# EasyEDA Pro project ProProject_Access Control AC Power Switch_2024-06-06.epro, schematic V2.0.1B Schematic
Create Date: 2024-05-14; Page Name: Main Page; Project Name: Access Control V2.1; Schematic Name: V2.0.1B Power Relay Schematic; Update Date: 2024-05-22; Company: RIT SHED MAKERSPACE; Drawn: Jim Heaney; Page Size: A4; Part Number: N/A; Reviewed: Jim Heaney; Version: V2.1.0
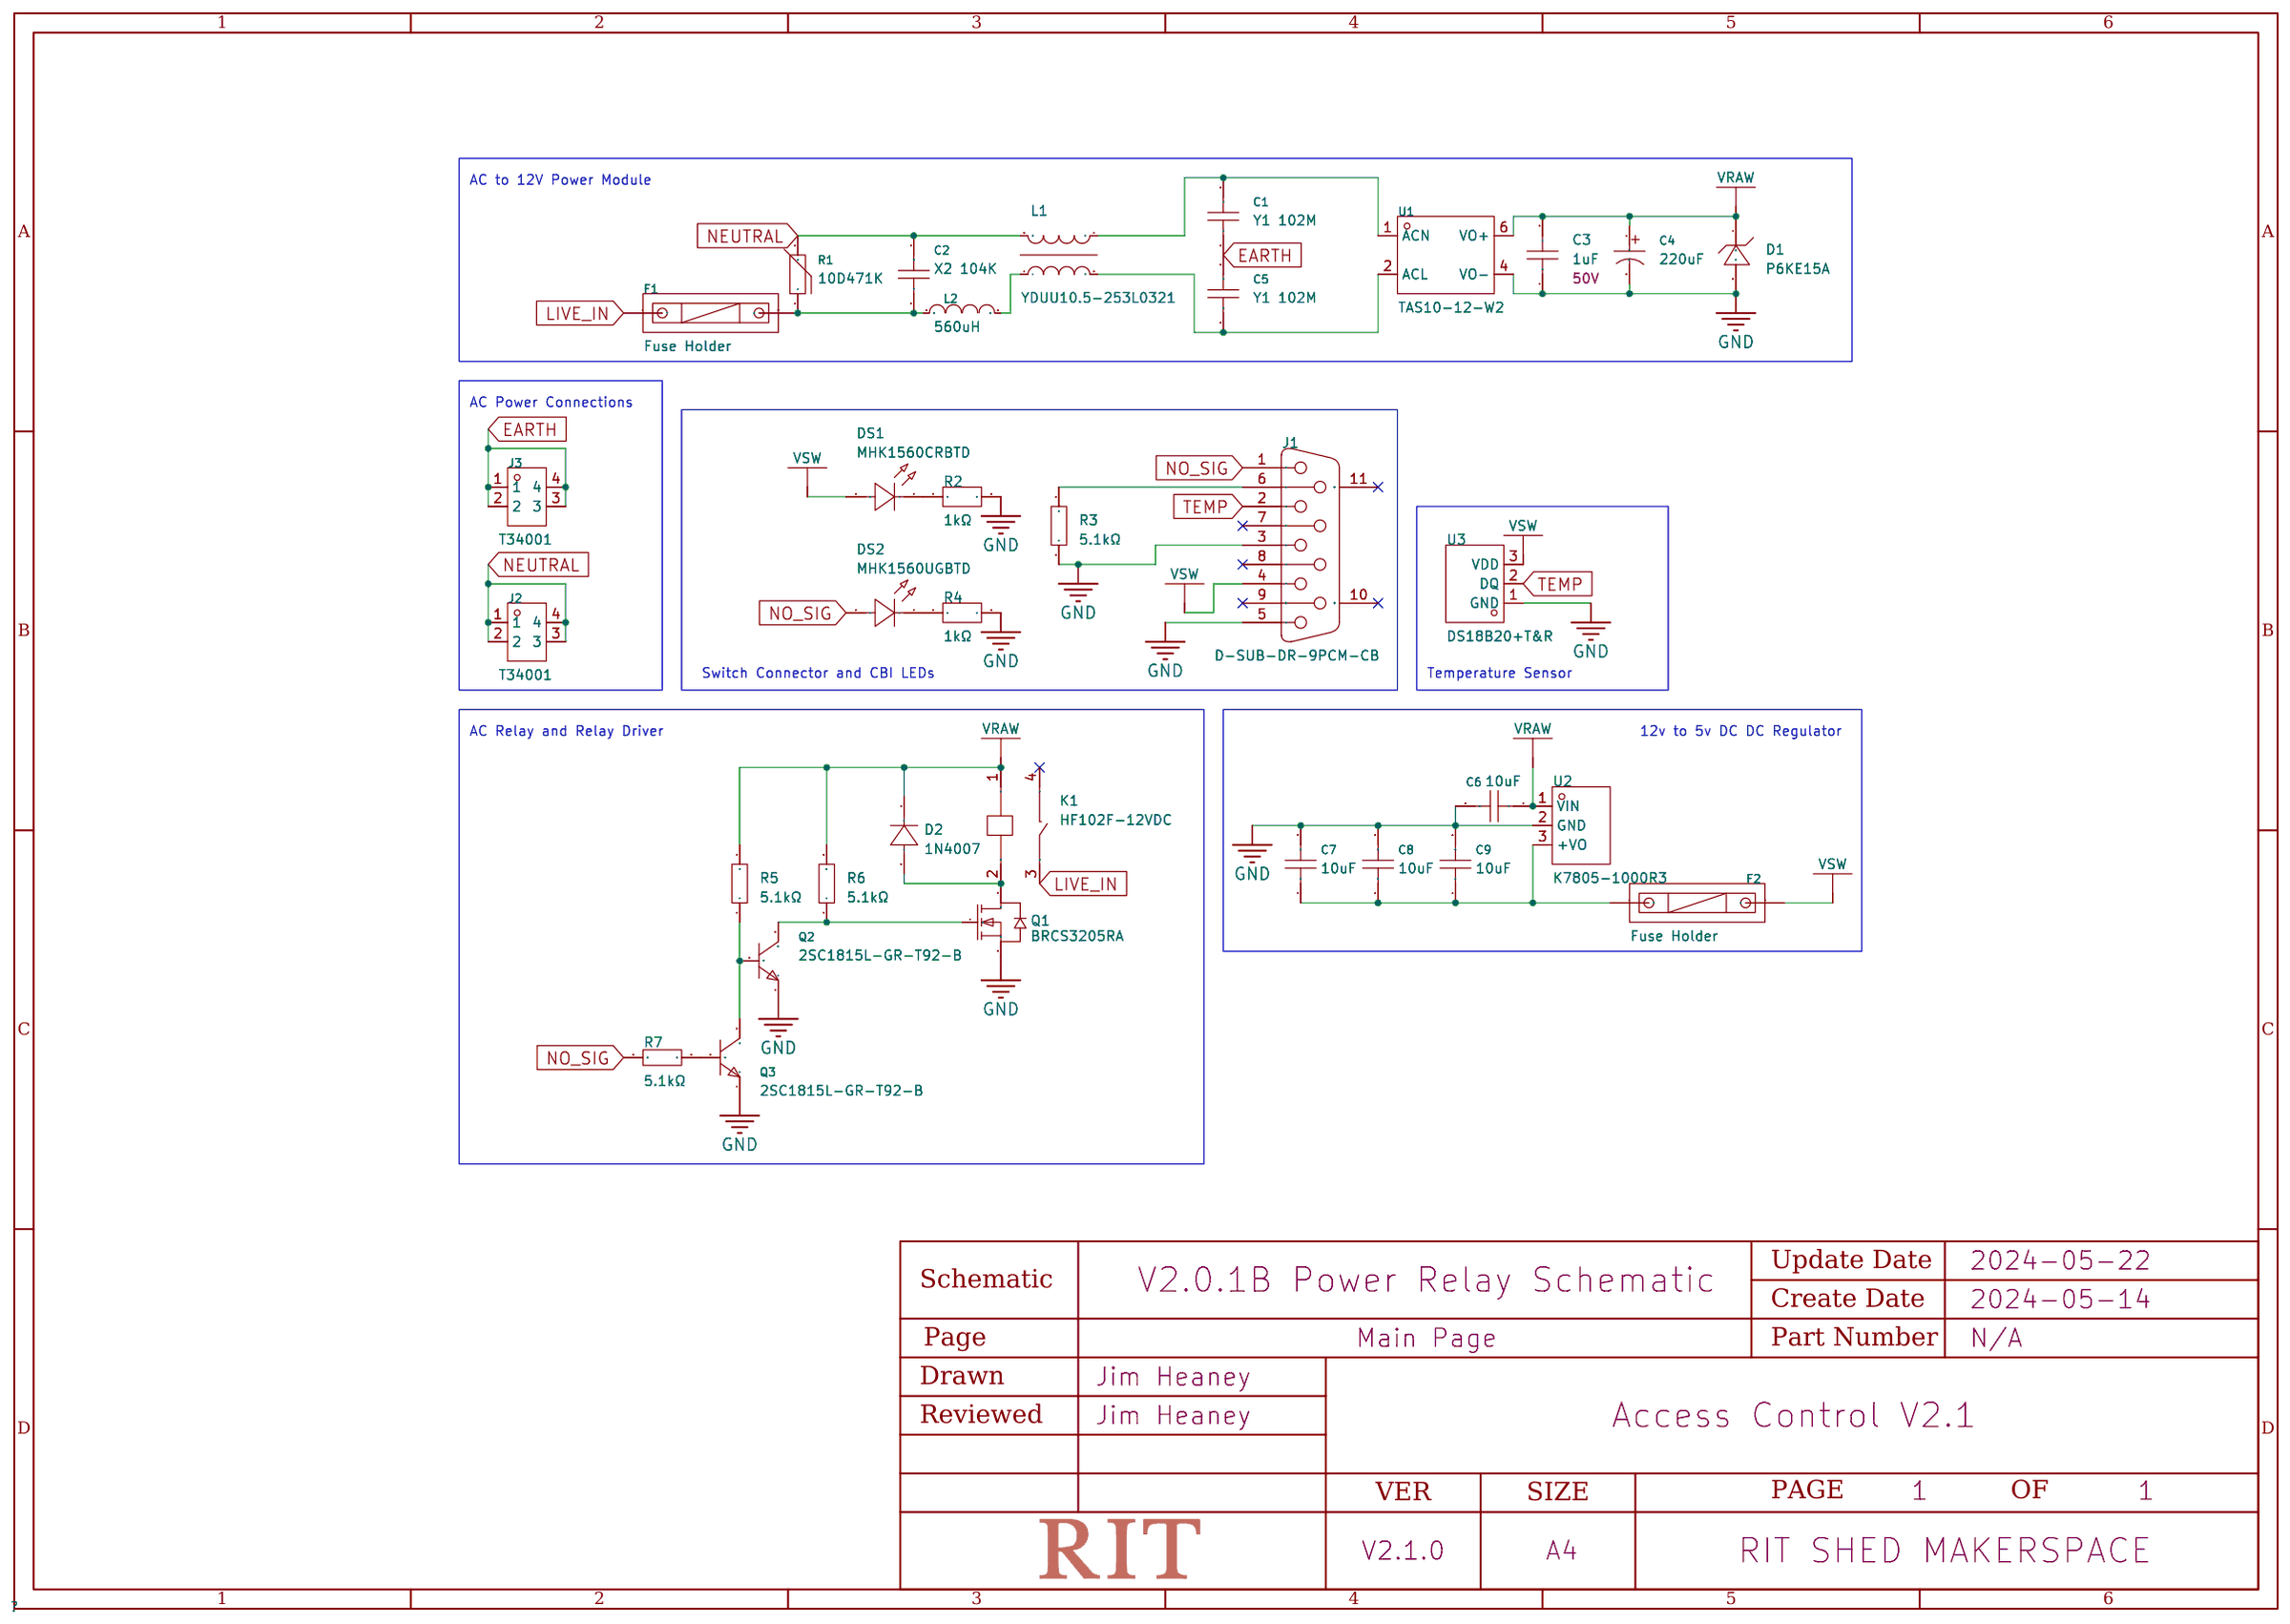
[diagram p1: schematic sheet]

## Parts
C1  1nF  [CAP-TH_L8.5-W5.0-P10.00-D0.6]
C2  100nF  [CAP-TH_L10.0-W5.0-P7.50-D0.6]
C3  1uF  [CAP-TH_L5.5-W3.5-P5.00-D1.2]
C4  220uF  [CAP-TH_BD6.3-P2.50-D1.0-FD]
C5  1nF  [CAP-TH_L8.5-W5.0-P10.00-D0.6]
C6  10uF  [CAP-TH_L5.5-W3.8-P3.50-D0.6]
C7  10uF  [CAP-TH_L5.5-W3.8-P3.50-D0.6]
C8  10uF  [CAP-TH_L5.5-W3.8-P3.50-D0.6]
C9  10uF  [CAP-TH_L5.5-W3.8-P3.50-D0.6]
D1  P6KE15A  [DO-15_BD3.2-L6.4-P10.40-D0.8-RD]
D2  1N4007  [DO-41_BD2.4-L4.7-P8.70-D0.8-RD]
DS1  MHK1560CRBTD  [LED-TH_MHK1560UGBTD]
DS2  MHK1560UGBTD  [LED-TH_MHK1560UGBTD]
F1  Fuse Holder  [FUSE-TH_L24.5-W9.8-P22.5]
F2  Fuse Holder  [FUSE-TH_L24.5-W9.8-P22.5]
J1  D-SUB-DR-9PCM-CB  [DB9-TH_ID09S33E4GV00LF]
J2  T34001  [CONN-TH_T34001]
J3  T34001  [CONN-TH_T34001]
K1  HF102F-12VDC  [RELAY-TH_HF102F-12VDC]
L1  YDUU10.5-253L0321  [IND-TH_4P-L19.0-W17.0]
L2  560uH  [IND-TH_BD9.0-P5.00-D0.7]
Q1  BRCS3205RA  [TO-220-3_L10.0-W4.5-P2.54-L]
Q2  2SC1815L-GR-T92-B  [TO-92-3_L4.9-W3.7-P2.54-L]
Q3  2SC1815L-GR-T92-B  [TO-92-3_L4.9-W3.7-P2.54-L]
R1  10D471K  [RES-TH_L12.5-W6.7-P7.50-D1.2]
R2  1kΩ  [RES-TH_BD2.3-L6.5-P10.50-D0.5]
R3  5.1kΩ  [RES-TH_BD2.3-L6.5-P10.50-D0.5]
R4  1kΩ  [RES-TH_BD2.3-L6.5-P10.50-D0.5]
R5  5.1kΩ  [RES-TH_BD2.3-L6.5-P10.50-D0.5]
R6  5.1kΩ  [RES-TH_BD2.3-L6.5-P10.50-D0.5]
R7  5.1kΩ  [RES-TH_BD2.3-L6.5-P10.50-D0.5]
U1  TAS10-12-W2  [PWRM-TH_TAS10-XX-W2]
U2  K7805-1000R3  [PWRM-TH_YLPTEC_K78XX-1000R3]
U3  DS18B20+T&R  [TO-92-3_L4.9-W3.7-P2.54-L]

## Library data of the parts
C1 C5 = VY1102M31Y5UC63V0: Capacitance: Tolerance:±20% Tolerance:±20% Voltage(AC):760V Subclass: Operating Temperature:-40℃~+125℃ Operating Temperature:-40℃~+125℃; LCSC Part Name: 等级:X1,Y1 1nF ±20% 760V; Supplier Part: C1620957; Manufacturer: VISHAY(威世); Supplier Footprint: 插件,P=10mm; JLCPCB Part Class: Extended Part; Datasheet: https://atta.szlcsc.com/upload/public/pdf/source/20210503/4C6D9DFEC0766624DBEA7F26F929BB18.pdf; Supplier: LCSC; Tolerance: ±20%; Voltage(AC): 760V; Operating Temperature: -40℃~+125℃
C2 = PX104K2C0702: Capacitance: Tolerance:±10% Tolerance:±10% Voltage(AC):310V；380V；350V Subclass: Operating Temperature:-40℃~+110℃ Operating Temperature:-40℃~+110℃; LCSC Part Name: 等级:X2 100nF ±10% 310V 350V 380V; Supplier Part: C2693793; Manufacturer: KYET(科雅); Supplier Footprint: 插件,P=7.5mm; JLCPCB Part Class: Extended Part; Datasheet: https://atta.szlcsc.com/upload/public/pdf/source/20230824/212A883DA7F3524E26A294E17BC5A0F4.pdf; Supplier: LCSC; Tolerance: ±10%; Voltage(AC): 310V；380V；350V; Operating Temperature: -40℃~+110℃
C3 = FK26X7R1H105KRE06: Capacitance: Tolerance:±10% Tolerance:±10% Voltage Rated: Lead Spacing: Temperature Coefficient:; LCSC Part Name: 1uF ±10% 50V; Supplier Part: C2839237; Manufacturer: TDK; Supplier Footprint: 插件,P=5mm; JLCPCB Part Class: Extended Part; Datasheet: https://atta.szlcsc.com/upload/public/pdf/source/20211011/CA0C243CD946D294CDFF83D03DB16AD9.pdf; Supplier: LCSC; Tolerance: ±10%; Voltage Rated: 50V
C4 = KM227M025E11RR0VH2FP0: Capacitance:220uF Tolerance:±20% Tolerance:±20% Rated Voltage: Ripple Current:- Equivalent Series Resistance(ESR):- Lead Spacing: φD: L: Lifetime @ Temp:1000hrs@105℃; LCSC Part Name: 220uF ±20% 25V; Supplier Part: C12450; Manufacturer: CX(承兴); Supplier Footprint: 插件,D6.3xL11mm; JLCPCB Part Class: Extended Part; Datasheet: https://atta.szlcsc.com/upload/public/pdf/source/20211027/06D6BA3719C264B639DC286D935D03EA.pdf; Supplier: LCSC; Tolerance: ±20%; Lifetime @ Temp: 1000hrs@105℃
C6-C9 = CD1E106MC9BER2F100: Capacitance:10uF Tolerance:±20% Tolerance:±20% Voltage Rated: Temperature Coefficient:; LCSC Part Name: 10uF ±20% 25V; Supplier Part: C2761733; Manufacturer: Dersonic(德尔创); Supplier Footprint: 插件,P=5.08mm; JLCPCB Part Class: Extended Part; Datasheet: https://atta.szlcsc.com/upload/public/pdf/source/20210512/C2761733_48A4F8FFA54EF14BEC181E01EC41507A.pdf; Supplier: LCSC; Tolerance: ±20%
D1 = P6KE15A_C1974865: polarity:Unidirectional Reverse Stand-Off Voltage (Vrwm):12.8V Maximum Clamping Voltage:21.2V Peak Pulse Current (Ipp)@10/1000us:28.8A Peak Pulse Power Dissipation (Ppp)@10/1000us:600W Breakdown Voltage:14.3V Type:TVS; LCSC Part Name: TVS 12.8V截止 28.8A峰值脉冲; Supplier Part: C1974865; Manufacturer: Littelfuse(美国力特); Supplier Footprint: DO-15(DO-204AC); JLCPCB Part Class: Extended Part; Datasheet: https://atta.szlcsc.com/upload/public/pdf/source/20210316/C2760121_CE745CC1535F4E7F6CA9D58EF9C8652B.pdf; Supplier: LCSC; polarity: Unidirectional; Reverse Stand-Off Voltage (Vrwm): 12.8V; Maximum Clamping Voltage: 21.2V; Peak Pulse Current (Ipp)@10/1000us: 28.8A; Peak Pulse Power Dissipation (Ppp)@10/1000us: 600W; Breakdown Voltage: 14.3V; Type: TVS
D2 = 1N4007_C2985028: Forward Voltage (Vf@If):1V@1A Reverse Voltage (Vr): Average Rectified Current (Io):; LCSC Part Name: 电压:1kV 电流:1A; Supplier Part: C2985028; Manufacturer: GOODWORK(固得沃克); Supplier Footprint: DO-41; JLCPCB Part Class: Extended Part; Datasheet: https://atta.szlcsc.com/upload/public/pdf/source/20210723/C2848669_ECFE0BC1B34B7BAAA686846FF0F306A7.pdf; Supplier: LCSC; Forward Voltage (Vf@If): 1V@1A
DS1 = MHK1560CGBTD: 20mA 雾状红透镜 50mcd -40℃~+85℃ 632nm Red 85° 1.75V~2.2V Plugin,P=2.54mm Light Emitting Diodes (LED) ROHS; LCSC Part Name: 1560直插单灯翠绿色光; Supplier Part: C7470835; Manufacturer: MEIHUA(美华); Supplier Footprint: 插件,P=2.54mm; JLCPCB Part Class: Extended Part; Datasheet: https://atta.szlcsc.com/upload/public/pdf/source/20231114/0151DB1F997DCF286213A722D08B4BAA.pdf; Supplier: LCSC; Emitted Color: Emerald; Forward Voltage (VF): 1.75V~2.2V; Forward Current: 20mA; Dominant Wavelength: 520nm; Lens Color: 雾状绿透镜; Luminous Intensity: 1000mcd; Viewing Angle: 85°; Operating Temperature: -40℃~+85℃
DS2 = MHK1560UGBTD: Emitted Color:Emerald Forward Voltage (VF):1.75V~2.2V Forward Voltage (VF):1.75V~2.2V Forward Current:20mA Dominant Wavelength:520nm Dominant Wavelength:520nm Lens Color:雾状绿透镜 Luminous Intensity:1000mcd Luminous Intensity:1000mcd Viewing Angle:85° Operati; LCSC Part Name: 1560直插单灯翠绿色光; Supplier Part: C7470833; Manufacturer: MEIHUA(美华); Supplier Footprint: 插件,P=2.54mm; JLCPCB Part Class: Extended Part; Datasheet: https://atta.szlcsc.com/upload/public/pdf/source/20231114/0151DB1F997DCF286213A722D08B4BAA.pdf; Supplier: LCSC; Emitted Color: Emerald; Forward Voltage (VF): 1.75V~2.2V; Forward Current: 20mA; Dominant Wavelength: 520nm; Lens Color: 雾状绿透镜; Luminous Intensity: 1000mcd; Viewing Angle: 85°; Operating Temperature: -40℃~+85℃
F1 F2 = 保险丝透明座: Fuseholder Type:- Fuse Type:- Fuse Size:-; LCSC Part Name: 保险丝座 5*20 透明座(两件套); Supplier Part: C58066; Manufacturer: xcfuse(旭程); JLCPCB Part Class: Extended Part; Datasheet: https://atta.szlcsc.com/upload/public/pdf/source/20201109/C58066_EF84FEEE40948BE1BD26BCA72E4FE443.pdf; Supplier: LCSC
J1 = D-SUB-DR-9PCM-CB: Connector Type:D-Sub Gender:Female Number of Pins:9P Mounting Style:Right-Angle Number of Rows:2 Current Rating (Max):3A Contact Plating:Tin Operating Temperature Range:-50℃~+105℃ Operating Temperature Range:-50℃~+105℃; LCSC Part Name: D-Sub 母 P数:9P; Supplier Part: C19077337; Manufacturer: XUNPU(讯普); Supplier Footprint: 弯插; JLCPCB Part Class: Extended Part; Datasheet: https://atta.szlcsc.com/upload/public/pdf/source/20231108/FB2E8AB0BE4F620DDF3F7F4D0B9AFB97.pdf; Supplier: LCSC; Connector Type: D-Sub; Gender: Female; Number of Pins: 9P; Mounting Style: Right-Angle; Number of Rows: 2; Current Rating (Max): 3A; Contact Plating: Tin; Operating Temperature Range: -50℃~+105℃
J2 J3 = T34001: LCSC Part Name: 四脚 M3 二件套; Supplier Part: C481448; Manufacturer: XFCN(兴飞); Supplier Footprint: 插件; JLCPCB Part Class: Extended Part; Datasheet: https://atta.szlcsc.com/upload/public/pdf/source/20200107/C481448_4214B4EB74A46B70BD82BA8A456D4EDD.pdf; Supplier: LCSC
K1 = HF102F-12VDC: Coil Voltage:12V Contact Form:一组常开:1A(SPST-常开) Pin Number:4 Contact Rating:20A@250VAC Maximum Switching Voltage:250V@AC Coil Rated Power:900mW Contact Material:AgCdO Maximum Switching Current:25A Coil Type:无极性-单线圈 Coil Resistance:640Ω Contact Resistance:1; LCSC Part Name: 小型大功率12V继电器 单刀单掷-常开 适用于电机负载; Supplier Part: C250652; Manufacturer: HF(宏发); Supplier Footprint: 插件,16x30.5mm; JLCPCB Part Class: Extended Part; Datasheet: https://atta.szlcsc.com/upload/public/pdf/source/20180709/C250652_2CDFE87553D11B6EDA7440E1EF3F00EA.pdf; Supplier: LCSC; Coil Voltage: 12V; Contact Form: 一组常开:1A(SPST-常开); Pin Number: 4; Contact Rating: 20A@250VAC; Maximum Switching Voltage: 250V@AC; Coil Rated Power: 900mW; Contact Material: AgCdO; Maximum Switching Current: 25A; Coil Type: 无极性-单线圈; Coil Resistance: 640Ω; Contact Resistance: 100mΩ; Operate Time: 20ms; Release Time: 10ms; Operating Temperature: -25℃~+85℃
L1 = YDUU10.5-253L0321: Number of Lines:2 Withstanding Voltage:1.5kV@AC Inductance @ Frequency:25mH@1KHz; LCSC Part Name: UU10.5 25mH @1KHz; Supplier Part: C5200263; Manufacturer: YJYCOIN(益嘉源); Supplier Footprint: 插件,19x17x22mm; JLCPCB Part Class: Extended Part; Datasheet: https://atta.szlcsc.com/upload/public/pdf/source/20221019/CF3EF2D4E89C9F1A1EF6A77931981DBC.pdf; Supplier: LCSC; Number of Lines: 2; Withstanding Voltage: 1.5kV@AC; Inductance @ Frequency: 25mH@1KHz
L2 = PK0810-561KB: Inductance: Tolerance:±10% Tolerance:±10% Rated Current: DC Resistance (DCR): Type:工字电感; LCSC Part Name: 560uH ±10%; Supplier Part: C122800; Manufacturer: SXN(顺翔诺); Supplier Footprint: 插件; JLCPCB Part Class: Extended Part; Datasheet: https://atta.szlcsc.com/upload/public/pdf/source/20210810/BA6D1DA7D4BCBB7C641BC97B42CFC6FF.pdf; Supplier: LCSC; Tolerance: ±10%; Type: 工字电感
Q1 = BRCS3205RA: Type:1个NChannel Drain Source Voltage (Vdss): Continuous Drain Current (Id): Power Dissipation (Pd): Drain Source On Resistance (RDS(on)@Vgs,Id):8mΩ@10V,90A Gate Threshold Voltage (Vgs(th)@Id):4V@250uA; LCSC Part Name: 1个N沟道 耐压:55V 电流:110A; Supplier Part: C328558; Manufacturer: BLUE ROCKET(蓝箭); Supplier Footprint: TO-220; JLCPCB Part Class: Extended Part; Datasheet: https://atta.szlcsc.com/upload/public/pdf/source/20240305/A90DF5FC3A17D55D4D137BD96C179E31.pdf; Supplier: LCSC; Type: 1个NChannel; Drain Source On Resistance (RDS(on)@Vgs,Id): 8mΩ@10V,90A; Gate Threshold Voltage (Vgs(th)@Id): 4V@250uA
Q2 Q3 = 2SC1815L-GR-T92-B: Transistor Type: Collector Current (Ic): Collector-Emitter Breakdown Voltage (Vceo): Power Dissipation (Pd):; LCSC Part Name: 耐压:50V 电流:150mA NPN hfe=200~400; Supplier Part: C73309; Manufacturer: UTC(友顺); Supplier Footprint: TO-92-2.54mm; JLCPCB Part Class: Extended Part; Datasheet: https://atta.szlcsc.com/upload/public/pdf/source/20170209/1486607344255.pdf; Supplier: LCSC
R1 = 10D471K_C8760: Varistor Voltage:423V~517V Varistor Voltage:423V~517V Clamping Voltage: Allowable Voltage (DC): Allowable Voltage (AC): Peak Current: Maximum Energy:42.3J Maximum Energy:42.3J Typical Capatitance:190pF@1kHz; LCSC Part Name: 钳位电压775V 42.3焦耳 插件压敏电阻; Supplier Part: C8760; Manufacturer: RUILON(瑞隆源); Supplier Footprint: 插件; JLCPCB Part Class: Extended Part; Datasheet: https://atta.szlcsc.com/upload/public/pdf/source/20160725/1469440740918.pdf; Supplier: LCSC; Varistor Voltage: 423V~517V; Maximum Energy: 42.3J; Typical Capatitance: 190pF@1kHz
R2 R4 = MF1/4W-1KΩ±1%T52: Type:Metal Film Resistors Resistance: Tolerance:±1% Tolerance:±1% Power(Watts):250mW Temperature Coefficient:±200ppm/℃ Temperature Coefficient:±200ppm/℃; LCSC Part Name: 金属膜电阻 1kΩ ±1% 250mW; Supplier Part: C713997; Manufacturer: 华星机电; Supplier Footprint: 插件,D2.3xL6.5mm; JLCPCB Part Class: Extended Part; Datasheet: https://atta.szlcsc.com/upload/public/pdf/source/20200731/C713882_AE8EB1102749D7E4FB4FB13DC898C429.pdf; Supplier: LCSC; Type: Metal Film Resistors; Tolerance: ±1%; Power(Watts): 250mW; Temperature Coefficient: ±200ppm/℃
R3 R5-R7 = CF1/4W-5.1KΩ±5% T: Type:Carbon Resister Resistance: Tolerance:±5% Tolerance:±5% Overload Voltage (Max):250V Power(Watts):250mW Temperature Coefficient:±350ppm/℃ Temperature Coefficient:±350ppm/℃ Operating Temperature Range:-55℃~+155℃ Operating Temperature Range:-55℃~+155℃; LCSC Part Name: 5.1kΩ ±5% 250mW 碳膜电阻; Supplier Part: C120072; Manufacturer: CCO(千志电子); Supplier Footprint: 插件,D2.3xL6.5mm; JLCPCB Part Class: Extended Part; Datasheet: https://atta.szlcsc.com/upload/public/pdf/source/20190910/C427328_A0A2D65F3FD547937F4E674C90868175.pdf; Supplier: LCSC; Type: Carbon Resister; Tolerance: ±5%; Overload Voltage (Max): 250V; Power(Watts): 250mW; Temperature Coefficient: ±350ppm/℃; Operating Temperature Range: -55℃~+155℃
U1 = TAS10-12-W2: Conversion Type:AC-DC；AC/DC-DC Input Voltage(DC):100V~370V Input Voltage(DC):100V~370V Output Voltage:12V Output Voltage:12V Output Power:10W Input Voltage(AC):85VAC~265VAC Input Voltage(AC):85VAC~265VAC Output Current (Max):830mA Output Current (Max):830; Supplier Part: C2687656; Manufacturer: TDPOWER(腾达电源); Supplier Footprint: 插件,25x39mm; JLCPCB Part Class: Extended Part; Datasheet: https://atta.szlcsc.com/upload/public/pdf/source/20210914/95F169B7B21081D929A6CFE8A15609A6.pdf; Supplier: LCSC; Conversion Type: AC-DC；AC/DC-DC; Input Voltage(DC): 100V~370V; Output Voltage: 12V; Output Power: 10W; Input Voltage(AC): 85VAC~265VAC; Output Current (Max): 830mA; Function: 降压型; Isolation or not: 隔离; Output Channel: 1; Insulated Voltage: 2.5kV@AC; Conversion Efficiency: 85%; Feature: Overcurrent Protection；短路保护自恢复
U2 = K7805-1000R3: Conversion Type:DC-DC Input Voltage(DC):8V~36V Input Voltage(DC):8V~36V Output Voltage:5V Output Voltage:5V Output Power:5W Output Current (Max):1A Output Current (Max):1A Function:升降压型 Isolation or not:非隔离 Output Channel:1 Insulated Voltage:- Conversion; LCSC Part Name: DC-DC 输入电压8V~36V 输出电压5V输出功率5W1000mA; Supplier Part: C2992391; Manufacturer: YLPTEC(易川); Supplier Footprint: 插件; JLCPCB Part Class: Extended Part; Datasheet: https://atta.szlcsc.com/upload/public/pdf/source/20220510/13042FEFCE8A01FC3BA968F60B4D6D28.pdf; Supplier: LCSC; Conversion Type: DC-DC; Input Voltage(DC): 8V~36V; Output Voltage: 5V; Output Power: 5W; Output Current (Max): 1A; Function: 升降压型; Isolation or not: 非隔离; Output Channel: 1; Conversion Efficiency: 93%; Feature: Short-Circuit Protection；Low-Power Consumption; Maximum Capacitive Load: 680uF
U3 = DS18B20+T&R: Supply Voltage:3V~5.5V Supply Voltage:3V~5.5V; Supplier Part: C880672; Manufacturer: ADI(亚德诺)/MAXIM(美信); Supplier Footprint: TO-92; JLCPCB Part Class: Extended Part; Datasheet: https://atta.szlcsc.com/upload/public/pdf/source/20201223/C880672_EEBB787AABBE3FE11FE7BE07B2E2EC5E.pdf; Supplier: LCSC; Supply Voltage: 3V~5.5V

## Nets
GND: C3.1 C4.2 C6.2 C7.2 C8.2 C9.2 D1.2(A) J1.3 J1.5 Q1.3(S) Q2.1(E) Q3.1(E) R2.2 R3.1 R4.2 U1.4(VO-) U2.2(GND) U3.1(GND)
EARTH: C1.1 C5.2 J3.1 J3.2 J3.3 J3.4
LIVE_IN: F1.1 K1.3
NEUTRAL: C2.2 J2.1 J2.2 J2.3 J2.4 L1.3 R1.2
NO_SIG: DS2.2(A) J1.1 R7.1
TEMP: J1.2 U3.2(DQ)
VRAW: C3.2 C4.1 C6.1 D1.1(C) D2.1(K) K1.1 R5.2 R6.2 U1.6(VO+) U2.1(VIN)
VSW: DS1.2(A) F2.2 J1.4 U3.3(VDD)
$1N597: C2.1 F1.2 L2.1 R1.1
$1N1225: C7.1 C8.1 C9.1 F2.1 U2.3(+VO)
$1N1636: D2.2(A) K1.2 Q1.2(D)
$1N1642: Q2.3(B) Q3.2(C) R5.1
$1N1643: Q3.3(B) R7.2
$1N1954: L1.4 L2.2
$1N1959: C5.1 L1.2 U1.2(ACL)
$1N1966: C1.2 L1.1 U1.1(ACN)
$1N3133: DS1.1(K) R2.1
$1N3135: DS2.1(K) R4.1
$1N3143: J1.6 R3.2
$1N3234: Q1.1(G) Q2.2(C) R6.1

Not connected (* = marked no-connect by the designer): J1 7* 8* 9* 10(MH1)* 11(MH2)*; K1 4*

## Notes on the sheet
- AC to 12V Power Module
- AC Power Connections
- Switch Connector and CBI LEDs
- Temperature Sensor
- AC Relay and Relay Driver
- 12v to 5v DC DC Regulator
